# EAGLE schematic DCC-reg (EAGLE 8.3.2)
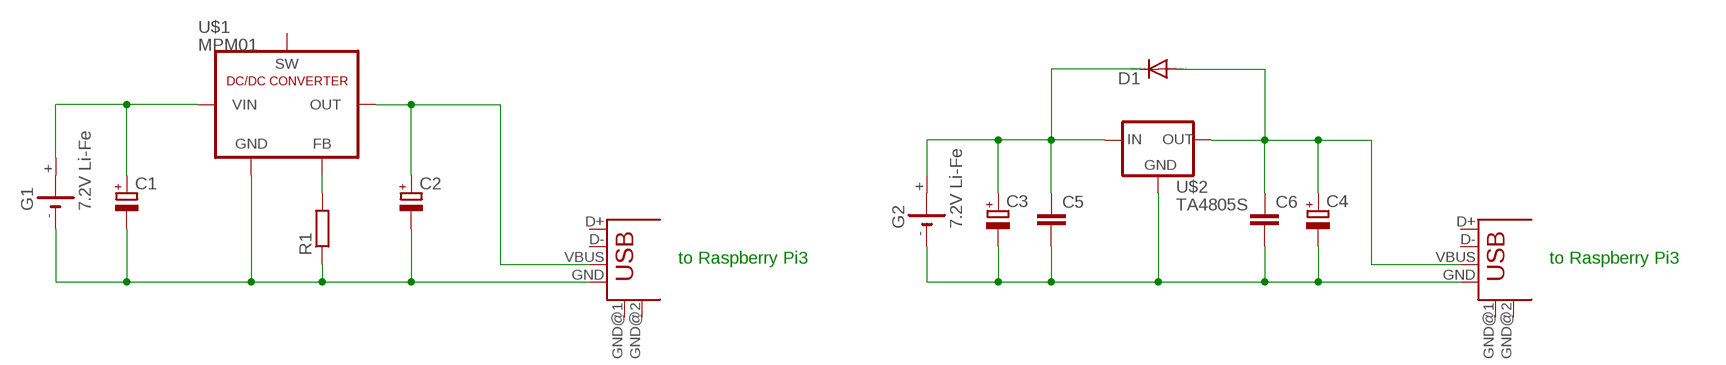
[diagram p0: schematic, sheet 1]

## Parts
C1  CPOL-EU085CS-1AR  [085CS_1AR]
C2  CPOL-EU085CS-1AR  [085CS_1AR]
C3  CPOL-EU085CS-1AR  [085CS_1AR]
C4  CPOL-EU085CS-1AR  [085CS_1AR]
C5  C-EU025-024X044  [C025-024X044]
C6  C-EU025-024X044  [C025-024X044]
D1  DIODE-D-7.5  [D-7.5]
G1  7.2V Li-Fe  1V60R  [1V60R]
G2  7.2V Li-Fe  1V60R  [1V60R]
R1  R-EU_0204/7  [0204/7]
U$1  MPM01  [MPM01]
U$2  TA4805S  [TA4805S]
USB1  USB-A-H  [USB-A-H]
USB2  USB-A-H  [USB-A-H]

## Nets
N$1: C2.+ U$1.P$5(OUT) U$1.P$6(OUT) U$1.P$7(OUT) USB1.VBUS
N$2: C1.- C2.- G1.- R1.1 U$1.P$1(GND) U$1.P$3(GND) USB1.GND
N$3: C4.+ C6.1 D1.A U$2.OUT USB2.VBUS
N$4: C3.- C4.- C5.2 C6.2 G2.- U$2.GND USB2.GND
N$5: C1.+ G1.+ U$1.P$2(VIN)
N$6: R1.2 U$1.P$4(FB)
N$7: C3.+ C5.1 D1.C G2.+ U$2.IN
Unconnected: G1.+@1(+) G2.+@1(+) U$1.P$8(SW) U$1.P$9(SW) USB1.D+ USB1.D- USB1.GND@1(GND) USB1.GND@2(GND) USB2.D+ USB2.D- USB2.GND@1(GND) USB2.GND@2(GND)

## Notes on the sheet
- to Raspberry Pi3 | to Raspberry Pi3

## Library data of the parts
C1-C4 = resistor:CPOL-EU: POLARIZED CAPACITOR, European symbol
C5 C6 = resistor:C-EU: CAPACITOR, European symbol
D1 = diode:DIODE-: DIODE
G1 G2 = battery:1V60R: NC ACCU Varta
R1 = resistor:R-EU_: RESISTOR, European symbol
U$1 = dc-dc-converter:MPM01
U$2 = v-reg-3:TA4805S
USB1 USB2 = con-usb-2:USB: USB Connectors